# Altium schematic sheet CPCIS_Connectors_P1_P6.SchDoc: DIOT
size 420 x 297 mm; SPICEModelCacheRMUUFYQV: <root> / <DocumentId>RMUUFYQV</DocumentId> / </root>; CheckedBy: P.Kulik; Author: G.Kasprowicz; CompanyName: WUT ISE; DrawnBy: G.Kasprowicz; Organization: WUT ISE; Address1: PW ISE; Address2: Nowowiejska 15/19 00-665 Warsaw; Address3: gkasprow@gmail.com; Revision: 2; SheetNumber: -; SheetTotal: -; ModifiedBy: -; CheckedDate: -; Title2: connectors; DivGrp: WUT ISE; Designer: G.Kasprowicz; ModifiedDate: -; ProjectName: Sensor Box
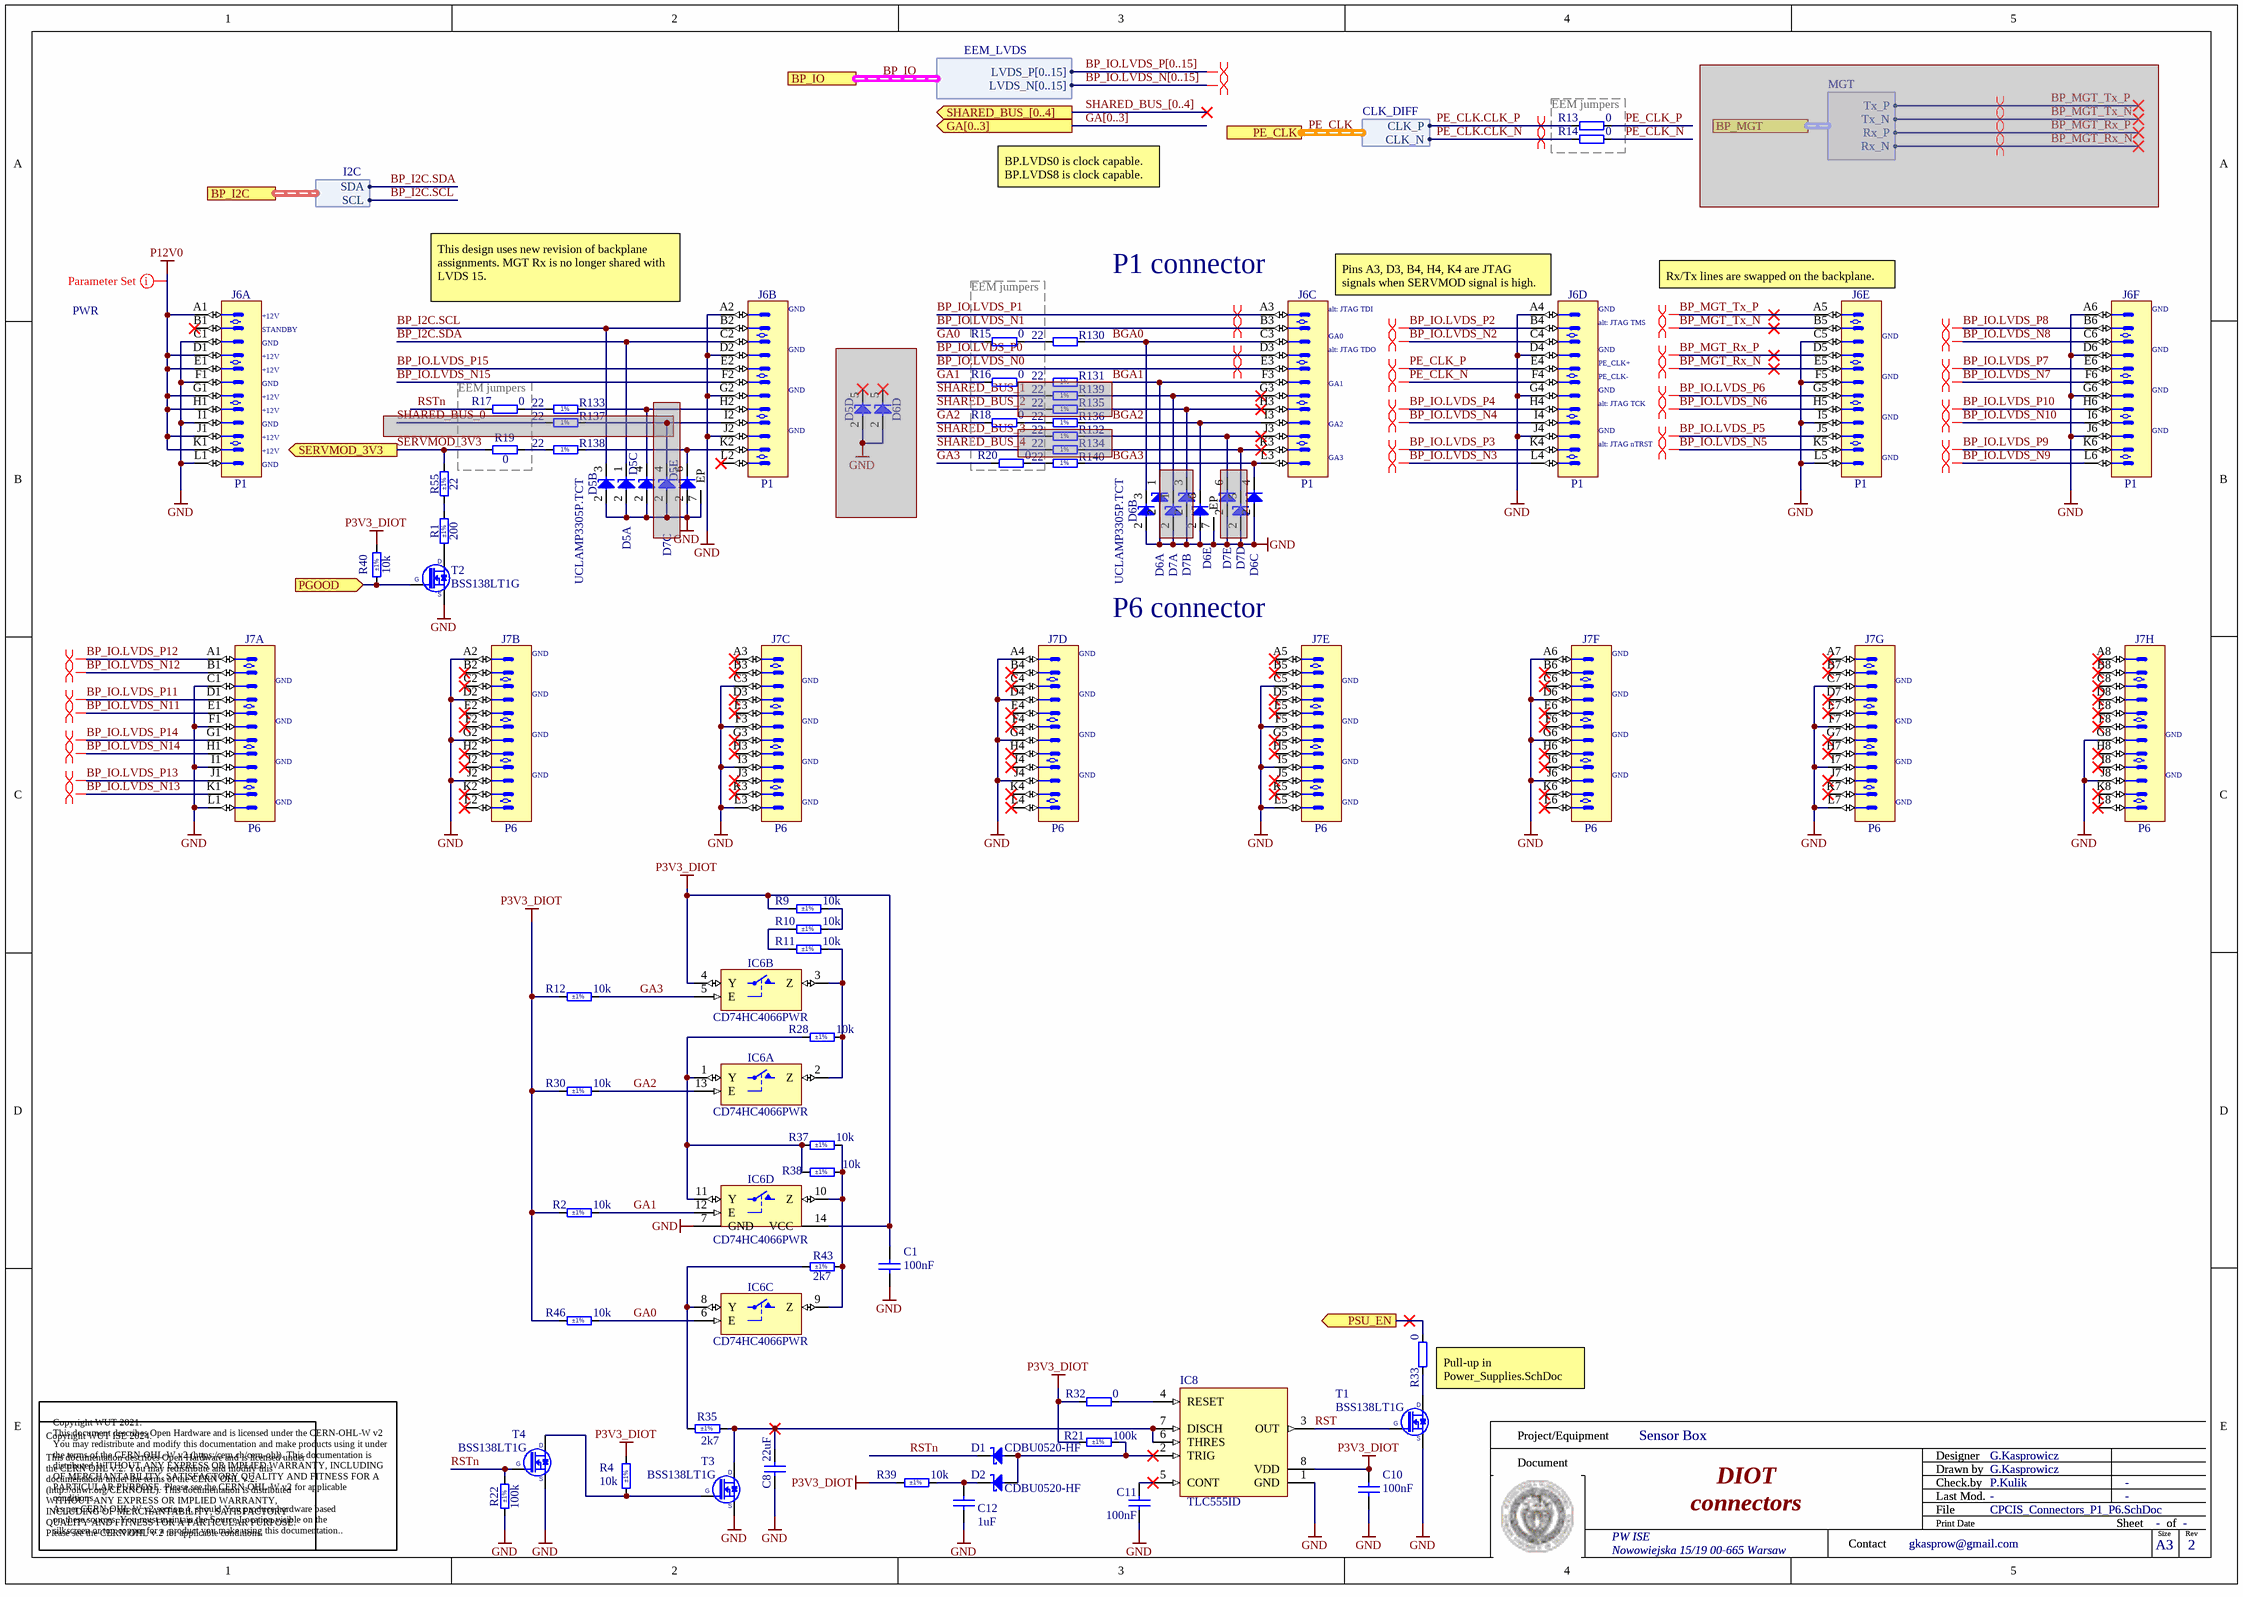
[diagram p0: CPCIS_Connectors_P1_P6.SchDoc]

## Parts
C1  100nF  [CAPC1005X55N]
C8  22uF  [CAPC2012X135N]
C10  100nF  [CAPC1005X55N]
C11  100nF  [CAPC1005X55N]
C12  1uF  [CAPC1608X87N]
D1  CDBU0520-HF  [SOD-523F]
D2  CDBU0520-HF  [SOD-523F]
D5  UCLAMP3305P.TCT  [SON50P160X65_HS-7N]  (value not drawn)  (parts A,B,C,D,E of 5)
D6  UCLAMP3305P.TCT  [SON50P160X65_HS-7N]  (value not drawn)  (parts A,B,C,D,E of 5)  (masked out: inside a compile mask, not in the netlist)
D7  PESD3V3L5UY  [SOT65P210X110-6N]  (value not drawn)  (parts A,B,C,D,E of 5)  (masked out: inside a compile mask, not in the netlist)
IC6  CD74HC4066PWR  [CD74HC4066PWR]  (parts A,B,C,D of 4)
IC8  TLC555ID  [SOIC127P600X175-8N]
J6  P1  [AMPHENOL_10052825-101LF]  (parts A,B,C,D,E,F of 6)
J7  P6  [AMPHENOL_10052838-101LF]  (parts A,B,C,D,E,F,G,H of 8)
R1  200  Tolerance: ±1%  [RESC1005X40N]
R2  10k  Tolerance: ±1%  [RESC1608X55N]
R4  10k  Tolerance: ±1%  [RESC1608X55N]
R9  10k  Tolerance: ±1%  [RESC1608X55N]
R10  10k  Tolerance: ±1%  [RESC1608X55N]
R11  10k  Tolerance: ±1%  [RESC1608X55N]
R12  10k  Tolerance: ±1%  [RESC1608X55N]
R13  0  [RESC1005X40N]
R14  0  [RESC1005X40N]
R15  0  [RESC1005X40N]
R16  0  [RESC1005X40N]
R17  0  [RESC1005X40N]
R18  0  [RESC1005X40N]
R19  0  [RESC1005X40N]
R20  0  [RESC1005X40N]
R21  100k  Tolerance: ±1%  [RESC1608X55N]
R22  100k  Tolerance: ±1%  [RESC1608X55N]
R28  10k  Tolerance: ±1%  [RESC1608X55N]
R30  10k  Tolerance: ±1%  [RESC1608X55N]
R32  0  [RESC1005X40N]
R33  0  [RESC1005X40N]
R35  2k7  Tolerance: ±1%  [RESC1608X55N]
R37  10k  Tolerance: ±1%  [RESC1608X55N]
R38  10k  Tolerance: ±1%  [RESC1608X55N]
R39  10k  Tolerance: ±1%  [RESC1608X55N]
R40  10k  Tolerance: ±1%  [RESC1608X55N]
R43  2k7  Tolerance: ±1%  [RESC1608X55N]
R46  10k  Tolerance: ±1%  [RESC1608X55N]
R55  22  Tolerance: ±1%  [RESC1005X40N]
R130  22  [RESC1005X40N]
R131  22  [RESC1005X40N]  (masked out: inside a compile mask, not in the netlist)
R132  22  [RESC1005X40N]  (masked out: inside a compile mask, not in the netlist)
R133  22  [RESC1005X40N]
R134  22  [RESC1005X40N]  (masked out: inside a compile mask, not in the netlist)
R135  22  [RESC1005X40N]  (masked out: inside a compile mask, not in the netlist)
R136  22  [RESC1005X40N]
R137  22  [RESC1005X40N]  (masked out: inside a compile mask, not in the netlist)
R138  22  [RESC1005X40N]
R139  22  [RESC1005X40N]  (masked out: inside a compile mask, not in the netlist)
R140  22  [RESC1005X40N]
T1  BSS138LT1G  [SOT95P240X110-3N]
T2  BSS138LT1G  [SOT95P240X110-3N]
T3  BSS138LT1G  [SOT95P240X110-3N]
T4  BSS138LT1G  [SOT95P240X110-3N]

## Blocks framed on the sheet
EEM jumpers: R13 R14
EEM jumpers: R15 R16 R18 R20
EEM jumpers: R17 R19

## Ports
BP_I2C (harness I2C), BP_IO (harness EEM_LVDS), BP_MGT (harness MGT), GA[0..3] (out), PE_CLK (harness CLK_DIFF), PGOOD (in), PSU_EN (out), SERVMOD_3V3 (out), SHARED_BUS_[0..4] (out)

## Harnesses
MGT: Tx_P, Tx_N, Rx_P, Rx_N
CLK_DIFF: CLK_N, CLK_P
I2C: SDA, SCL
EEM_LVDS: LVDS_P[0..15], LVDS_N[0..15]

## Nets
GND: C1.1 C8.1 C10.1 C11.1 C12.1 D5.2(A) D5.7(EP) D6.2(A) D6.7(EP) IC6.7(GND) IC8.1(GND) J6.A2 J6.A4 J6.A6 J6.C1 J6.C5 J6.D2 J6.D4 J6.D6 J6.F1 J6.F5 J6.G2 J6.G4 J6.G6 J6.I1 J6.I5 J6.J2 J6.J4 J6.J6 J6.L1 J6.L5 J7.A2 J7.A4 J7.A6 J7.C1 J7.C3 J7.C5 J7.C7 J7.D2 J7.D4 J7.D6 J7.F1 J7.F3 J7.F5 J7.F7 J7.G2 J7.G4 J7.G6 J7.G8 J7.I1 J7.I3 J7.I5 J7.I7 J7.J2 J7.J4 J7.J6 J7.J8 J7.L1 J7.L3 J7.L5 J7.L7 R22.1 T1.2(S) T2.2(S) T3.2(S) T4.2(S)
P3V3_DIOT: C1.2 C10.2 IC6.4(Y) IC6.14(VCC) IC8.8(VDD) R2.1 R4.2 R9.1 R12.1 R21.1 R30.1 R32.1 R39.1 R40.2 R46.1
P12V0: J6.A1 J6.D1 J6.E1 J6.G1 J6.H1 J6.J1 J6.K1
BGA0: D6.3(C) J6.C3 R130.2
BGA2: D6.6(C) J6.I3 R136.2
BGA3: D6.4(C) J6.L3 R140.2
BP_I2C.SCL: D5.3(C) J6.B2 ; port BP_I2C.SCL
BP_I2C.SDA: D5.1(C) J6.C2 ; port BP_I2C.SDA
BP_IO.LVDS_N0: J6.E3
BP_IO.LVDS_N1: J6.B3
BP_IO.LVDS_N2: J6.C4
BP_IO.LVDS_N3: J6.L4
BP_IO.LVDS_N4: J6.I4
BP_IO.LVDS_N5: J6.K5
BP_IO.LVDS_N6: J6.H5
BP_IO.LVDS_N7: J6.F6
BP_IO.LVDS_N8: J6.C6
BP_IO.LVDS_N9: J6.L6
BP_IO.LVDS_N10: J6.I6
BP_IO.LVDS_N11: J7.E1
BP_IO.LVDS_N12: J7.B1
BP_IO.LVDS_N13: J7.K1
BP_IO.LVDS_N14: J7.H1
BP_IO.LVDS_N15: J6.F2
BP_IO.LVDS_P0: J6.D3
BP_IO.LVDS_P1: J6.A3
BP_IO.LVDS_P2: J6.B4
BP_IO.LVDS_P3: J6.K4
BP_IO.LVDS_P4: J6.H4
BP_IO.LVDS_P5: J6.J5
BP_IO.LVDS_P6: J6.G5
BP_IO.LVDS_P7: J6.E6
BP_IO.LVDS_P8: J6.B6
BP_IO.LVDS_P9: J6.K6
BP_IO.LVDS_P10: J6.H6
BP_IO.LVDS_P11: J7.D1
BP_IO.LVDS_P12: J7.A1
BP_IO.LVDS_P13: J7.J1
BP_IO.LVDS_P14: J7.G1
BP_IO.LVDS_P15: J6.E2
BP_MGT_Rx_N: J6.E5
BP_MGT_Rx_P: J6.D5
BP_MGT_Tx_N: J6.B5
BP_MGT_Tx_P: J6.A5
GA0: IC6.6(E) R15.1 R46.2
GA1: IC6.12(E) R2.2 R16.1
GA2: IC6.13(E) R18.1 R30.2
GA3: IC6.5(E) R12.2 R20.1
PE_CLK.CLK_N: R14.1 ; port PE_CLK.CLK_N
PE_CLK.CLK_P: R13.1 ; port PE_CLK.CLK_P
PE_CLK_N: J6.F4 R14.2
PE_CLK_P: J6.E4 R13.2
PGOOD: R40.1 T2.1(G) ; port PGOOD
PSU_EN: R33.2 ; port PSU_EN
RST: IC8.3(OUT) T1.1(G)
RSTn: D1.1(C) R17.1 R22.2 T4.1(G)
SERVMOD_3V3: R19.1 R55.2 ; port SERVMOD_3V3
NetC8_2: C8.2 IC8.6(THRES) IC8.7(DISCH) R35.2 T3.3(D)
NetC11_2: C11.2 IC8.5(CONT)
NetC12_2: C12.2 D2.1(C) R39.2
NetD1_2: D1.2(A) D2.2(A) IC8.2(TRIG) R21.2
NetD5_4: D5.4(C) J6.H2 R133.2
NetD5_6: D5.6(C) J6.K2 R138.2
NetIC6_1: IC6.1(Y) IC6.11(Y) R28.1 R37.1 R38.1
NetIC6_2: IC6.2(Z) IC6.3(Z) R11.2 R28.2
NetIC6_8: IC6.8(Y) R35.1 R43.1
NetIC6_9: IC6.9(Z) IC6.10(Z) R37.2 R38.2 R43.2
NetIC8_4: IC8.4(RESET) R32.2
NetR1_1: R1.1 T2.3(D)
NetR1_2: R1.2 R55.1
NetR4_1: R4.1 T3.1(G) T4.3(D)
NetR9_2: R9.2 R10.2
NetR10_1: R10.1 R11.1
NetR15_2: R15.2 R130.1
NetR17_2: R17.2 R133.1
NetR18_2: R18.2 R136.1
NetR19_2: R19.2 R138.1
NetR20_2: R20.2 R140.1
NetR33_1: R33.1 T1.3(D)

Not connected (* = marked no-connect by the designer): J6 B1* F3 G3* H3* I2 J3* K3* L2*; J7 A3* A5* A7* A8* B2* B3* B4* B5* B6* B7* B8* C2* C4* C6* C8* D3* D5* D7* D8* E2* E3* E4* E5* E6* E7* E8* F2* F4* F6* F8* G3* G5* G7* H2* H3* H4* H5* H6* H7* H8* I2* I4* I6* I8* J3* J5* J7* K2* K3* K4* K5* K6* K7* K8* L2* L4* L6* L8*; R16 2

## Buses and harness runs
bus BP_IO.LVDS_N[0..15]
bus BP_IO.LVDS_P[0..15]
bus GA[0..3] = port GA[0..3]
bus SHARED_BUS_[0..4] = port SHARED_BUS_[0..4]
harness BP_IO = port BP_IO
harness PE_CLK = port PE_CLK

## Layout directives
differential pair: (no net found under the mark), BP_IO.LVDS_N0, BP_IO.LVDS_N1, BP_IO.LVDS_N2, BP_IO.LVDS_N3, BP_IO.LVDS_N4, BP_IO.LVDS_N5, BP_IO.LVDS_N6, BP_IO.LVDS_N7, BP_IO.LVDS_N8, BP_IO.LVDS_N9, BP_IO.LVDS_N10, BP_IO.LVDS_N11, BP_IO.LVDS_N12, BP_IO.LVDS_N13, BP_IO.LVDS_N14, BP_IO.LVDS_P0, BP_IO.LVDS_P1, BP_IO.LVDS_P2, BP_IO.LVDS_P3, BP_IO.LVDS_P4, BP_IO.LVDS_P5, BP_IO.LVDS_P6, BP_IO.LVDS_P7, BP_IO.LVDS_P8, BP_IO.LVDS_P9, BP_IO.LVDS_P10, BP_IO.LVDS_P11, BP_IO.LVDS_P12, BP_IO.LVDS_P13, BP_IO.LVDS_P14
differential pair; differential pair class Diff_100Ohm: PE_CLK.CLK_N, PE_CLK.CLK_P, PE_CLK_N, PE_CLK_P
differential pair; differential pair class MGT: (no net found under the mark), BP_MGT_Rx_N, BP_MGT_Rx_P, BP_MGT_Tx_N, BP_MGT_Tx_P
net class PWR: P12V0

## Notes on the sheet
- BP.LVDS0 is clock capable.
  BP.LVDS8 is clock capable.
- (near J6) +12V
- This design uses new revision of backplane assignments. MGT Rx is no longer shared with LVDS 15.
- (near J6) GND
- (near J6) P1 connector
- (near J6) alt: JTAG TDI
- (near J6) Pins A3, D3, B4, H4, K4 are JTAG signals when SERVMOD signal is high.
- (near J6) alt: JTAG TMS
- (near J6) Rx/Tx lines are swapped on the backplane.
- (near J6) STANDBY
- GND
- (near J6) alt: JTAG TDO
- (near J6) GA1
- (near J6) GA0
- (near J6) PE_CLK+
- (near J6) PE_CLK-
- (near J6) GA2
- (near J6) GA3
- (near J6) alt: JTAG TCK
- (near J6) alt: JTAG nTRST
- (near J7) GND
- (near J7) P6 connector
- (near R33) Pull-up in Power_Supplies.SchDoc
- Project/Equipment
- Document
- Designer
- Drawn by
- Check.by
- Copyright WUT ISE 2024.
  This documentation describes Open Hardware and is licensed under the CERN OHL v.2. You may redistribute and modify this documentation under the terms of the CERN OHL v.2. (http://ohwr.org/CERNOHL). This documentation is distributed WITHOUT ANY EXPRESS OR IMPLIED WARRANTY, INCLUDING OF MERCHANTABILITY, SATISFACTORY QUALITY AND FITNESS FOR A PARTICULAR PURPOSE. Please see the CERN OHL v.2 for applicable conditions.
- Contact
- File
- Last Mod.
- Print Date
- Sheet
- Size
- A3
- of
- Rev
- Copyright WUT 2021.
  This document describes Open Hardware and is licensed under the CERN-OHL-W v2
  You may redistribute and modify this documentation and make products using it under the terms of the CERN-OHL-W v2 (https:/cern.ch/cern-ohl). This documentation is distributed WITHOUT ANY EXPRESS OR IMPLIED WARRANTY, INCLUDING OF MERCHANTABILITY, SATISFACTORY QUALITY AND FITNESS FOR A PARTICULAR PURPOSE. Please see the CERN-OHL-W v2 for applicable conditions.
  As per CERN-OHL-W v2 section 4, should You produce hardware based
  on these sources, You must maintain the Source Location visible on the
  silkscreen or top copper for a  product you make using this documentation..
- (in symbol R0402_22R_1%_0.0625W_100PPM) 1%

## Library data of the parts
C1 C10 C11 = CC0402_100NF_50V_10%_X7R: Non-polarised capacitor; Part Description: SMD Multilayer Chip Ceramic Capacitor; Manufacturer: GENERIC; Manufacturer1 Part Number: GRM155R71H104KE14D; Voltage: 50V; TC: X7R; Tolerance: ±10%; Part Number: CC0402_100NF_50V_10%_X7R; Component Kind: Standard; Component Type: Standard; Pin Count: 2; Value: 100nF; Status: None; Manufacturer Part Number: CC0402_100NF_50V_10%_X7R; Case: 0402; Mounted: Yes; Socket: No; SMD: Yes; Sense: No; Manufacturer1 Example: MURATA; Manufacturer1 ComponentHeight: 0.55mm; HelpURL: \\cern.ch\dfs\Applications\Altium\Datasheets\CC0402_MURATA_GRM155R71H104KE14D.pdf; Author: CERN DEM MR; CreateDate: 30.06.2017; LatestRevisionDate: 30.06.2017
C8 = CC0805_22UF_16V_10%_X5R: Non-polarised capacitor; Part Description: SMD Multilayer Chip Ceramic Capacitor; Manufacturer: GENERIC; Manufacturer1 Part Number: C2012X5R1C226KT; Voltage: 16V; TC: X5R; Tolerance: ±10%; Part Number: CC0805_22UF_16V_10%_X5R; Component Kind: Standard; Component Type: Standard; Pin Count: 2; Value: 22uF; Status: Preferred; Manufacturer Part Number: CC0805_22UF_16V_10%_X5R; Case: 0805; Mounted: Yes; Socket: No; SMD: Yes; Sense: No; Manufacturer1 Example: TDK; Manufacturer1 ComponentHeight: 1.35mm; HelpURL: \\cern.ch\dfs\Applications\Altium\Datasheets\CC0805_X5R_TDK_C.pdf; Author: CERN DEM JLC; CreateDate: 25.10.2012; LatestRevisionDate: 25.10.2012
C12 = CC0603_1UF_25V_10%_X7R: Non-polarised capacitor; Part Description: SMD Multilayer Chip Ceramic Capacitor; Manufacturer: GENERIC; Manufacturer1 Part Number: GRM188R71E105KA12D; Voltage: 25V; TC: X7R; Tolerance: ±10%; Part Number: CC0603_1UF_25V_10%_X7R; Component Kind: Standard; Component Type: Standard; Pin Count: 2; Value: 1uF; Status: None; Manufacturer Part Number: CC0603_1UF_25V_10%_X7R; Case: 0603; Mounted: Yes; Socket: No; SMD: Yes; Sense: No; Manufacturer1 Example: MURATA; Manufacturer1 ComponentHeight: 0.9mm; HelpURL: \\cern.ch\dfs\Applications\Altium\Datasheets\CC0603_X7R_MURATA.pdf; Author: CERN DEM JLC; CreateDate: 18.01.2011; LatestRevisionDate: 18.01.2011
D1 D2 = CDBU0520-HF: Schottky Diode; Part Description: 20V Surface mount Schottky Barrier Diode; Manufacturer: COMCHIP; Voltage: 20V; Power: 500mA; PressFit: No; Bonding: No; Part Number: CDBU0520-HF; Component Kind: Standard; Component Type: Standard; Device: CDBU0520-HF; PackageDescription: Small Outline Diode Flat Lead (SOD-523F), Body; 1.80mm L X 1mm W X 0.85mm H; Manufacturer Part Number: CDBU0520-HF; Pin Count: 2; Case: SOD-523F; Mounted: Yes; Socket: No; SMD: Yes; Sense: No; ComponentHeight: 1mm; HelpURL: \\cern.ch\dfs\Applications\Altium\Datasheets\CDBU0520-HF.pdf; Author: CERN DEM HF; CreateDate: 13.10.2023; LatestRevisionDate: 13.10.2023
D5 D6 = CMP-004-00037-2: Diode TVS Quint Common Anode Uni-Dir 3.3V 40W 6-Pin SLP EP T/R; Max Operating Temperature: 125°C; Min Operating Temperature: -55°C; Pins: 6; Mounting Technology: Surface Mount
D7 = PESD3V3L5UY: Fivefold ESD Protection Diode Arrays; Part Description: Fivefold ESD Protection Diode Arrays (30kV); Manufacturer: NEXPERIA; Voltage: 3.3V; Power: 200W; PressFit: No; Bonding: No; Part Number: PESD3V3L5UY; Component Kind: Standard; Component Type: Standard; Device: PESD3V3L5UY; PackageDescription: SOT363, SC-88, 0.65mm Pitch; 6 Pin, 1.25mm W X 2.00mm L X 1.10mm H body, IPC Medium Density; Manufacturer Part Number: PESD3V3L5UY; Pin Count: 6; Case: SOT363; Mounted: Yes; Socket: No; SMD: Yes; Sense: No; ComponentHeight: 1.1mm; HelpURL: \\cern.ch\dfs\Applications\Altium\Datasheets\PESD3V3L5UY.pdf; Author: CERN DEM WB; CreateDate: 05.07.2021; LatestRevisionDate: 05.07.2021
IC6 = CMP-016-00739-2: 12-V, 1: 1 (SPST), (SPST), 4-channel analog switch 14-TSSOP -55 to 125; Min Supply Voltage: 2V; Max Supply Voltage: 10V; Mounting Technology: Surface Mount; Min Operating Temperature: -55°C; Case/Package: TSSOP; Pins: 14; Max Operating Temperature: 125°C
IC8 = TLC555ID: LinCMOS Timer; Manufacturer: TEXAS INSTRUMENTS; PressFit: No; Bonding: No; Part Number: TLC555ID; Component Kind: Standard; Component Type: Standard; Device: TLC555ID; PackageDescription: SOIC 8, Pitch 1.27mm, Body 4x5mm, IPC Medium Density; Part Description: LinCMOS Timer; Manufacturer Part Number: TLC555ID; Pin Count: 8; Case: SOIC8; Mounted: Yes; Socket: No; SMD: Yes; Sense: No; ComponentHeight: 1.75mm; Author: CERN DEM JMW; HelpURL: \\cern.ch\dfs\Applications\Altium\Datasheets\TLC555ID.pdf; CreateDate: 23.08.2016; LatestRevisionDate: 23.08.2016
J6 = AMPHENOL_10052825-101LF: 72 Contacts Header, 6 Columns, 4 Pairs per Column; Part Description: 72 Contacts, 2mm Pitch, 6 Columns, 4 Pairs per Column, 4 Walls, Right Angle Header; Part Number: AMPHENOL_10052825-101LF; Component Kind: Standard; Component Type: Standard; Pin Count: 72; Family: AirMax VS; Mounted: Yes; Socket: No; SMD: No; PressFit: Yes; Sense: No; Status: None; Manufacturer: AMPHENOL; Manufacturer Part Number: 10052825-101LF; ComponentHeight: 15.35mm; HelpURL: \\cern.ch\dfs\Applications\Altium\Datasheets\AMPHENOL_10052825-101LF.pdf; ComponentLink1URL: \\cern.ch\dfs\Applications\Altium\Datasheets\AMPHENOL_10052825-101LF_Application.pdf; ComponentLink1Description: Application; Author: CERN DEM MR; CreateDate: 19/02/2018; LatestRevisionDate: 19/02/2018; Classname: Overlapping
J7 = AMPHENOL_10052838-101LF: 96 Contacts Header, 8 Columns, 4 Pairs per Column; Part Description: 96 Contacts, 2mm Pitch, 8 Columns, 4 Pairs per Column, 4 Walls, Right Angle Header; Part Number: AMPHENOL_10052838-101LF; Component Kind: Standard; Component Type: Standard; Pin Count: 96; Family: AirMax VS; Mounted: Yes; Socket: No; SMD: No; PressFit: Yes; Sense: No; Status: None; Manufacturer: AMPHENOL; Manufacturer Part Number: 10052838-101LF; ComponentHeight: 15.35mm; HelpURL: \\cern.ch\dfs\Applications\Altium\Datasheets\AMPHENOL_10052838-101LF.pdf; ComponentLink1URL: \\cern.ch\dfs\Applications\Altium\Datasheets\AMPHENOL_10052838-101LF_Application.pdf; ComponentLink1Description: Application; Author: CERN DEM MR; CreateDate: 19.02.2018; LatestRevisionDate: 19.02.2018
R1 = R0402_200R_1%_0.0625W_100PPM: Resistor - 1%; Part Description: General Purpose Thick Film Chip Resistor; Manufacturer: GENERIC; Manufacturer1 Part Number: 232270672001L; TC: ±100ppm/°C; PressFit: No; Part Number: R0402_200R_1%_0.0625W_100PPM; Component Kind: Standard; Component Type: Standard; Pin Count: 2; Value: 200; Status: Not Recommended; Power: 0.0625W; Manufacturer Part Number: R0402_200R_1%_0.0625W_100PPM; Case: 0402; Mounted: Yes; Sense: No; Socket: No; SMD: Yes; Manufacturer1 Example: YAGEO PHYCOMP; Manufacturer1 ComponentHeight: 0.4mm; HelpURL: \\cern.ch\dfs\Applications\Altium\Datasheets\R0402_Phycomp_RC0402.pdf; Author: CERN DEM JLC; CreateDate: 03.12.2007; LatestRevisionDate: 17.10.2012
R2 R4 R9-R12 R28 R30 R37-R40 R46 = R0603_10K_1%_0.1W_100PPM: Resistor - 1%; Part Description: General Purpose Thick Film Chip Resistor; Manufacturer: GENERIC; Manufacturer1 Part Number: NRC06F1002TRF; Power: 0.1W; TC: ±100ppm/°C; PressFit: No; Part Number: R0603_10K_1%_0.1W_100PPM; Component Kind: Standard; Component Type: Standard; Pin Count: 2; Value: 10k; Status: Preferred; Manufacturer Part Number: R0603_10K_1%_0.1W_100PPM; Case: 0603; Mounted: Yes; Sense: No; Socket: No; SMD: Yes; Manufacturer1 Example: NIC COMPONENT; Manufacturer1 ComponentHeight: 0.55mm; HelpURL: \\cern.ch\dfs\Applications\Altium\Datasheets\R0603_NIC_NRC.pdf; Author: CERN DEM JLC; CreateDate: 03.12.2007; LatestRevisionDate: 13.03.2008
R13-R20 R32 R33 = R0402_0R_JUMPER: Resistor; Part Description: 1A (0.05R Max DC Resistance) Zero Ohm Jumper; Manufacturer: GENERIC; Manufacturer1 Part Number: 232270591001L; PressFit: No; Part Number: R0402_0R_JUMPER; Component Kind: Standard; Component Type: Standard; Pin Count: 2; Value: 0; Status: Not Recommended; Manufacturer Part Number: R0402_0R_JUMPER; Case: 0402; Mounted: Yes; Sense: No; Socket: No; SMD: Yes; Manufacturer1 Example: YAGEO PHYCOMP; Manufacturer1 ComponentHeight: 0.4mm; HelpURL: \\cern.ch\dfs\Applications\Altium\Datasheets\R0402_Phycomp_RC0402.pdf; Author: CERN DEM JLC; CreateDate: 03.12.2007; LatestRevisionDate: 17.10.2012
R21 R22 = R0603_100K_1%_0.1W_100PPM: Resistor - 1%; Part Description: General Purpose Thick Film Chip Resistor; Manufacturer: GENERIC; Manufacturer1 Part Number: NRC06F1003TRF; Power: 0.1W; TC: ±100ppm/°C; PressFit: No; Part Number: R0603_100K_1%_0.1W_100PPM; Component Kind: Standard; Component Type: Standard; Pin Count: 2; Value: 100k; Status: Preferred; Manufacturer Part Number: R0603_100K_1%_0.1W_100PPM; Case: 0603; Mounted: Yes; Sense: No; Socket: No; SMD: Yes; Manufacturer1 Example: NIC COMPONENT; Manufacturer1 ComponentHeight: 0.55mm; HelpURL: \\cern.ch\dfs\Applications\Altium\Datasheets\R0603_NIC_NRC.pdf; Author: CERN DEM JLC; CreateDate: 03.12.2007; LatestRevisionDate: 13.03.2008
R35 R43 = R0603_2K7_1%_0.1W_100PPM: Resistor - 1%; Part Description: General Purpose Thick Film Chip Resistor; Manufacturer: GENERIC; Manufacturer1 Part Number: RC0603FR-072K7L; Power: 0.1W; TC: ±100ppm/°C; PressFit: No; Part Number: R0603_2K7_1%_0.1W_100PPM; Component Kind: Standard; Component Type: Standard; Pin Count: 2; Value: 2k7; Status: Preferred; Manufacturer Part Number: R0603_2K7_1%_0.1W_100PPM; Case: 0603; Mounted: Yes; Sense: No; Socket: No; SMD: Yes; Manufacturer1 Example: YAGEO PHYCOMP; Manufacturer1 ComponentHeight: 0.55mm; HelpURL: \\cern.ch\dfs\Applications\Altium\Datasheets\R0603_PHYCOMP_RC0603.pdf; Author: CERN DEM JLC; CreateDate: 02.05.2011; LatestRevisionDate: 02.05.2011
R55 = R0402_22R_1%_0.0625W_100PPM: Resistor - 1%; Part Description: General Purpose Thick Film Chip Resistor; Manufacturer: GENERIC; Manufacturer1 Part Number: 232270672209L; TC: ±100ppm/°C; PressFit: No; Part Number: R0402_22R_1%_0.0625W_100PPM; Component Kind: Standard; Component Type: Standard; Pin Count: 2; Value: 22; Status: Not Recommended; Power: 0.0625W; Manufacturer Part Number: R0402_22R_1%_0.0625W_100PPM; Case: 0402; Mounted: Yes; Sense: No; Socket: No; SMD: Yes; Manufacturer1 Example: YAGEO PHYCOMP; Manufacturer1 ComponentHeight: 0.4mm; HelpURL: \\cern.ch\dfs\Applications\Altium\Datasheets\R0402_Phycomp_RC0402.pdf; Author: CERN DEM JLC; CreateDate: 03.12.2007; LatestRevisionDate: 17.10.2012
R130-R140 = R0402_22R_1%_0.0625W_100PPM: Resistor - 1%; Part Description: General Purpose Thick Film Chip Resistor; Manufacturer: GENERIC; Manufacturer1 Part Number: 232270672209L; PressFit: No; Part Number: R0402_22R_1%_0.0625W_100PPM; Component Kind: Standard; Component Type: Standard; Pin Count: 2; Value: 22; Status: Not Recommended; Power: 0.0625W; Tolerance: ±1%; Manufacturer Part Number: R0402_22R_1%_0.0625W_100PPM; Case: 0402; Mounted: Yes; Socket: No; SMD: Yes; Manufacturer1 Example: YAGEO PHYCOMP; Manufacturer1 ComponentHeight: 0.4mm; HelpURL: \\cern.ch\dfs\Applications\Altium\Datasheets\R0402_Phycomp_RC0402.pdf; Author: CERN DEM JLC; CreateDate: 03.12.2007; LatestRevisionDate: 17.10.2012; Sense: No
T1-T4 = BSS138LT1G: N-CHANNEL MOSFET WITH DIODE; Part Description: 50V, 200mA N-Channel Enhancement Mode Field-Effect Transistor; Manufacturer: ON SEMICONDUCTOR; PressFit: No; Bonding: No; Part Number: BSS138LT1G; Component Kind: Standard; Component Type: Standard; Device: BSS138LT1G; PackageDescription: SOT23, 0.95mm Pitch; 3 Pin, 1.40mm W X 3.00mm L X 1.10mm H body, IPC Medium Density; Manufacturer Part Number: BSS138L; Pin Count: 3; Case: SOT23-3; Mounted: Yes; Socket: No; SMD: Yes; Sense: No; ComponentHeight: 1.11mm; HelpURL: \\cern.ch\dfs\Applications\Altium\Datasheets\BSS138LT1G.pdf; Author: CERN DEM JLC; CreateDate: 23.03.2009; LatestRevisionDate: 25.05.2022